# Altium schematic sheet AD9851.SchDoc
size A4
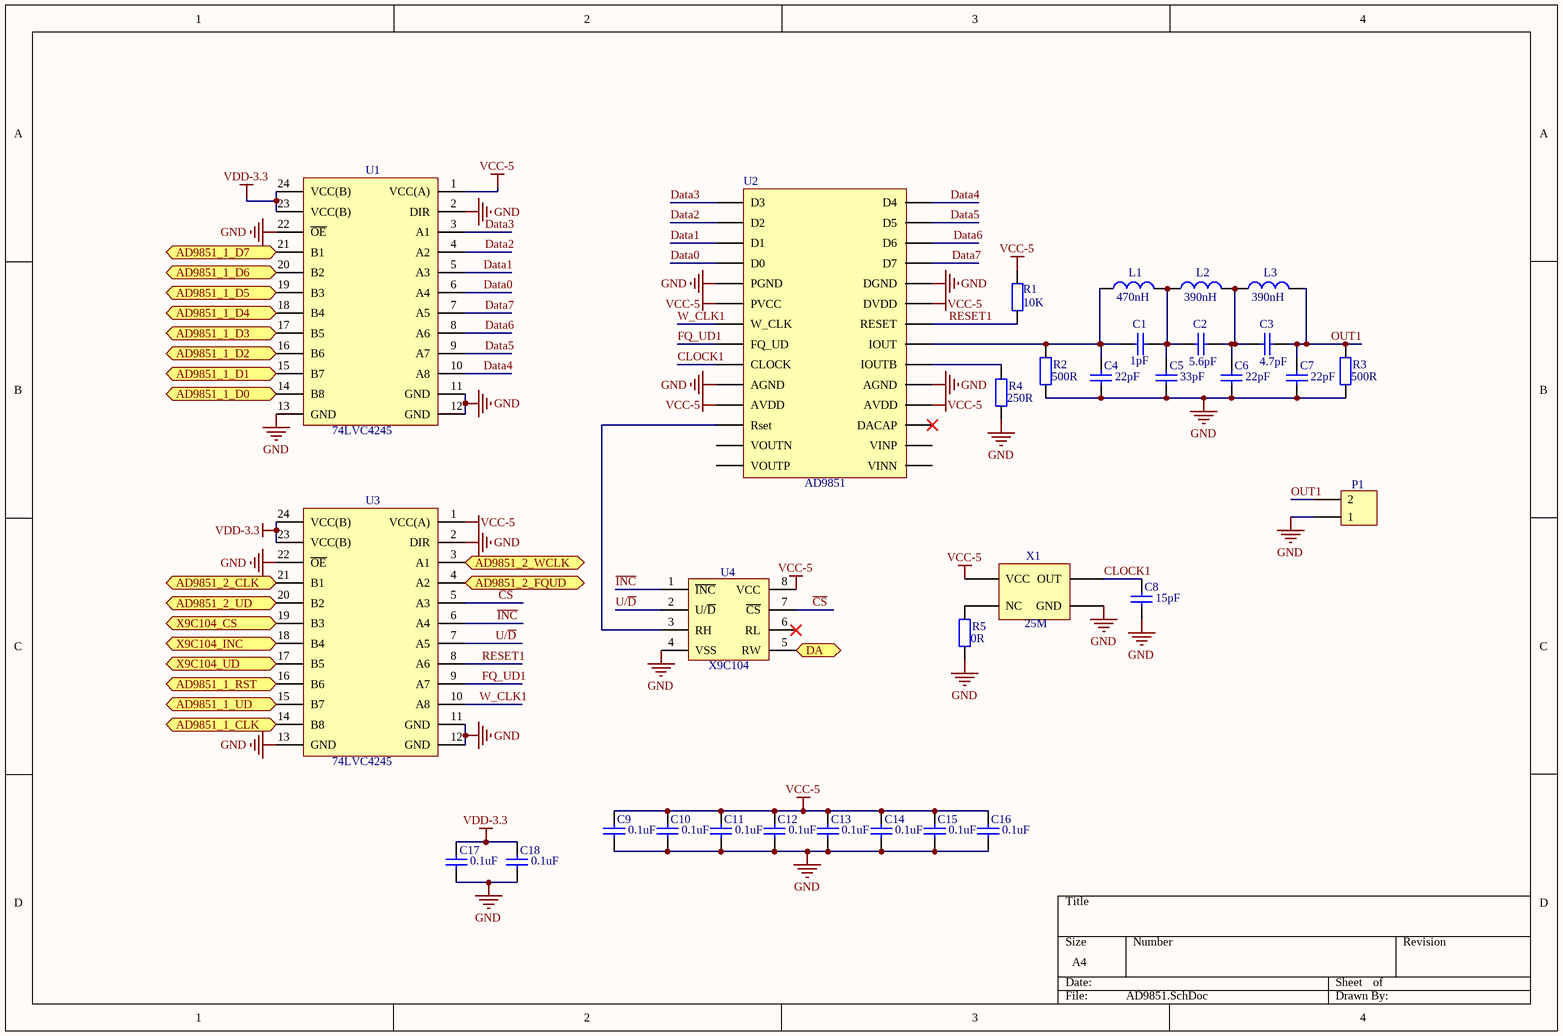
[diagram p0: AD9851.SchDoc]

## Parts
C1  value 1pF  [0603]  (hidden comment: Capacitor-0603)
C2  value 5.6pF  [0603]  (hidden comment: Capacitor-0603)
C3  value 4.7pF  [0603]  (hidden comment: Capacitor-0603)
C4  value 22pF  [0603]  (hidden comment: Capacitor-0603)
C5  value 33pF  [0603]  (hidden comment: Capacitor-0603)
C6  value 22pF  [0603]  (hidden comment: Capacitor-0603)
C7  value 22pF  [0603]  (hidden comment: Capacitor-0603)
C8  value 15pF  [0603]  (hidden comment: Capacitor-0603)
C9  value 0.1uF  [0603]  (hidden comment: Capacitor-0603)
C10  value 0.1uF  [0603]  (hidden comment: Capacitor-0603)
C11  value 0.1uF  [0603]  (hidden comment: Capacitor-0603)
C12  value 0.1uF  [0603]  (hidden comment: Capacitor-0603)
C13  value 0.1uF  [0603]  (hidden comment: Capacitor-0603)
C14  value 0.1uF  [0603]  (hidden comment: Capacitor-0603)
C15  value 0.1uF  [0603]  (hidden comment: Capacitor-0603)
C16  value 0.1uF  [0603]  (hidden comment: Capacitor-0603)
C17  value 0.1uF  [0603]  (hidden comment: Capacitor-0603)
C18  value 0.1uF  [0603]  (hidden comment: Capacitor-0603)
L1  value 470nH  [0805]  (hidden comment: Inductor)
L2  value 390nH  [0805]  (hidden comment: Inductor)
L3  value 390nH  [0805]  (hidden comment: Inductor)
P1  端子  [2MM接线端子]  (value not drawn)
R1  value 10K  [0603]  (hidden comment: Resistor-0603)
R2  value 500R  [0603]  (hidden comment: Resistor-0603)
R3  value 500R  [0603]  (hidden comment: Resistor-0603)
R4  value 250R  [0603]  (hidden comment: Resistor-0603)
R5  value 0R  [0603]  (hidden comment: Resistor-0603)
U1  74LVC4245  [74LVC4245-PW]
U2  AD9851  [AD9851]
U3  74LVC4245  [74LVC4245-PW]
U4  X9C104数字电位器  [X9C104]  (value not drawn)
X1  value 25M  [有源晶振7050]  (hidden comment: 有源晶振)

## Ports
AD9851_1_CLK (in), AD9851_1_D0 (in), AD9851_1_D1 (in), AD9851_1_D2 (in), AD9851_1_D3 (in), AD9851_1_D4 (in), AD9851_1_D5 (in), AD9851_1_D6 (in), AD9851_1_D7 (in), AD9851_1_RST (in), AD9851_1_UD (in), AD9851_2_CLK (in), AD9851_2_FQUD (out), AD9851_2_UD (in), AD9851_2_WCLK (out), DA (in), X9C104_CS (in), X9C104_INC (in), X9C104_UD (in)

## Nets
GND: C4.1 C5.1 C6.1 C7.1 C8.1 C9.1 C10.1 C11.1 C12.1 C13.1 C14.1 C15.1 C16.1 C17.1 C18.1 P1.1 R2.1 R3.1 R4.1 R5.1 U1.2(DIR) U1.11(GND) U1.12(GND) U1.13(GND) U1.22(~{OE}) U2.5(PGND) U2.10(AGND) U2.19(AGND) U2.24(DGND) U3.2(DIR) U3.11(GND) U3.12(GND) U3.13(GND) U3.22(~{OE}) U4.4(VSS) X1.2(GND)
VCC-5: C9.2 C10.2 C11.2 C12.2 C13.2 C14.2 C15.2 C16.2 R1.2 U1.1(VCC(A)) U2.6(PVCC) U2.11(AVDD) U2.18(AVDD) U2.23(DVDD) U3.1(VCC(A)) U4.8(VCC) X1.4(VCC)
VDD-3.3: C17.2 C18.2 U1.23(VCC(B)) U1.24(VCC(B)) U3.23(VCC(B)) U3.24(VCC(B))
AD9851_1_CLK: U3.14(B8) ; port AD9851_1_CLK
AD9851_1_D0: U1.14(B8) ; port AD9851_1_D0
AD9851_1_D1: U1.15(B7) ; port AD9851_1_D1
AD9851_1_D2: U1.16(B6) ; port AD9851_1_D2
AD9851_1_D3: U1.17(B5) ; port AD9851_1_D3
AD9851_1_D4: U1.18(B4) ; port AD9851_1_D4
AD9851_1_D5: U1.19(B3) ; port AD9851_1_D5
AD9851_1_D6: U1.20(B2) ; port AD9851_1_D6
AD9851_1_D7: U1.21(B1) ; port AD9851_1_D7
AD9851_1_RST: U3.16(B6) ; port AD9851_1_RST
AD9851_1_UD: U3.15(B7) ; port AD9851_1_UD
AD9851_2_CLK: U3.21(B1) ; port AD9851_2_CLK
AD9851_2_FQUD: U3.4(A2) ; port AD9851_2_FQUD
AD9851_2_UD: U3.20(B2) ; port AD9851_2_UD
AD9851_2_WCLK: U3.3(A1) ; port AD9851_2_WCLK
~{CS}: U3.5(A3) U4.7(~{CS})
CLOCK1: C8.2 U2.9(CLOCK) X1.3(OUT)
DA: U4.5(RW) ; port DA
Data0: U1.6(A4) U2.4(D0)
Data1: U1.5(A3) U2.3(D1)
Data2: U1.4(A2) U2.2(D2)
Data3: U1.3(A1) U2.1(D3)
Data4: U1.10(A8) U2.28(D4)
Data5: U1.9(A7) U2.27(D5)
Data6: U1.8(A6) U2.26(D6)
Data7: U1.7(A5) U2.25(D7)
FQ_UD1: U2.8(FQ_UD) U3.9(A7)
~{INC}: U3.6(A4) U4.1(~{INC})
OUT1: C3.1 C7.2 L3.2 P1.2 R3.2
RESET1: R1.1 U2.22(RESET) U3.8(A6)
U/~{D}: U3.7(A5) U4.2(U/~{D})
W_CLK1: U2.7(W_CLK) U3.10(A8)
X9C104_CS: U3.19(B3) ; port X9C104_CS
X9C104_INC: U3.18(B4) ; port X9C104_INC
X9C104_UD: U3.17(B5) ; port X9C104_UD
NetC1_1: C1.1 C2.2 C5.2 L1.2 L2.1
NetC1_2: C1.2 C4.2 L1.1 R2.2 U2.21(IOUT)
NetC2_1: C2.1 C3.2 C6.2 L2.2 L3.1
NetR4_2: R4.2 U2.20(IOUTB)
NetR5_2: R5.2 X1.1(NC)
NetU2_12: U2.12(Rset) U4.3(RH)

Not connected (* = marked no-connect by the designer): U2 13(VOUTN) 14(VOUTP) 15(VINN) 16(VINP) 17(DACAP)*; U4 6(RL)*

## Library data of the parts
U1 U3 = 74LVC4245: Name: 74LVC4245
U2 = AD9851: Name: AD9851
U4 = X9C104数字电位器: Name: X9C104